# Altium schematic sheet ARDUINO_extension_connectors.SchDoc: ARDUINO_extension_connectors
size A3; Date: Not used; ApprovedBy: Not used; CheckedBy: Not used; Author: Not used; CompanyName: STMicroelectronics; DrawnBy: Not used; Engineer: Not used; Organization: Not used; Address1: Not used; Address2: Not used; Address3: Not used; Address4: Not used; DocumentNumber: 5; Revision: Not used; SheetNumber: 5; SheetTotal: 9; CurrentTime: Not used; CurrentDate: Not used; Time: Not used; DocumentFullPathAndName: Not used; DocumentName: Not used; ModifiedDate: Not used; ImagePath: Not used; ProjectName: Not used; Application_BuildNumber: Not used
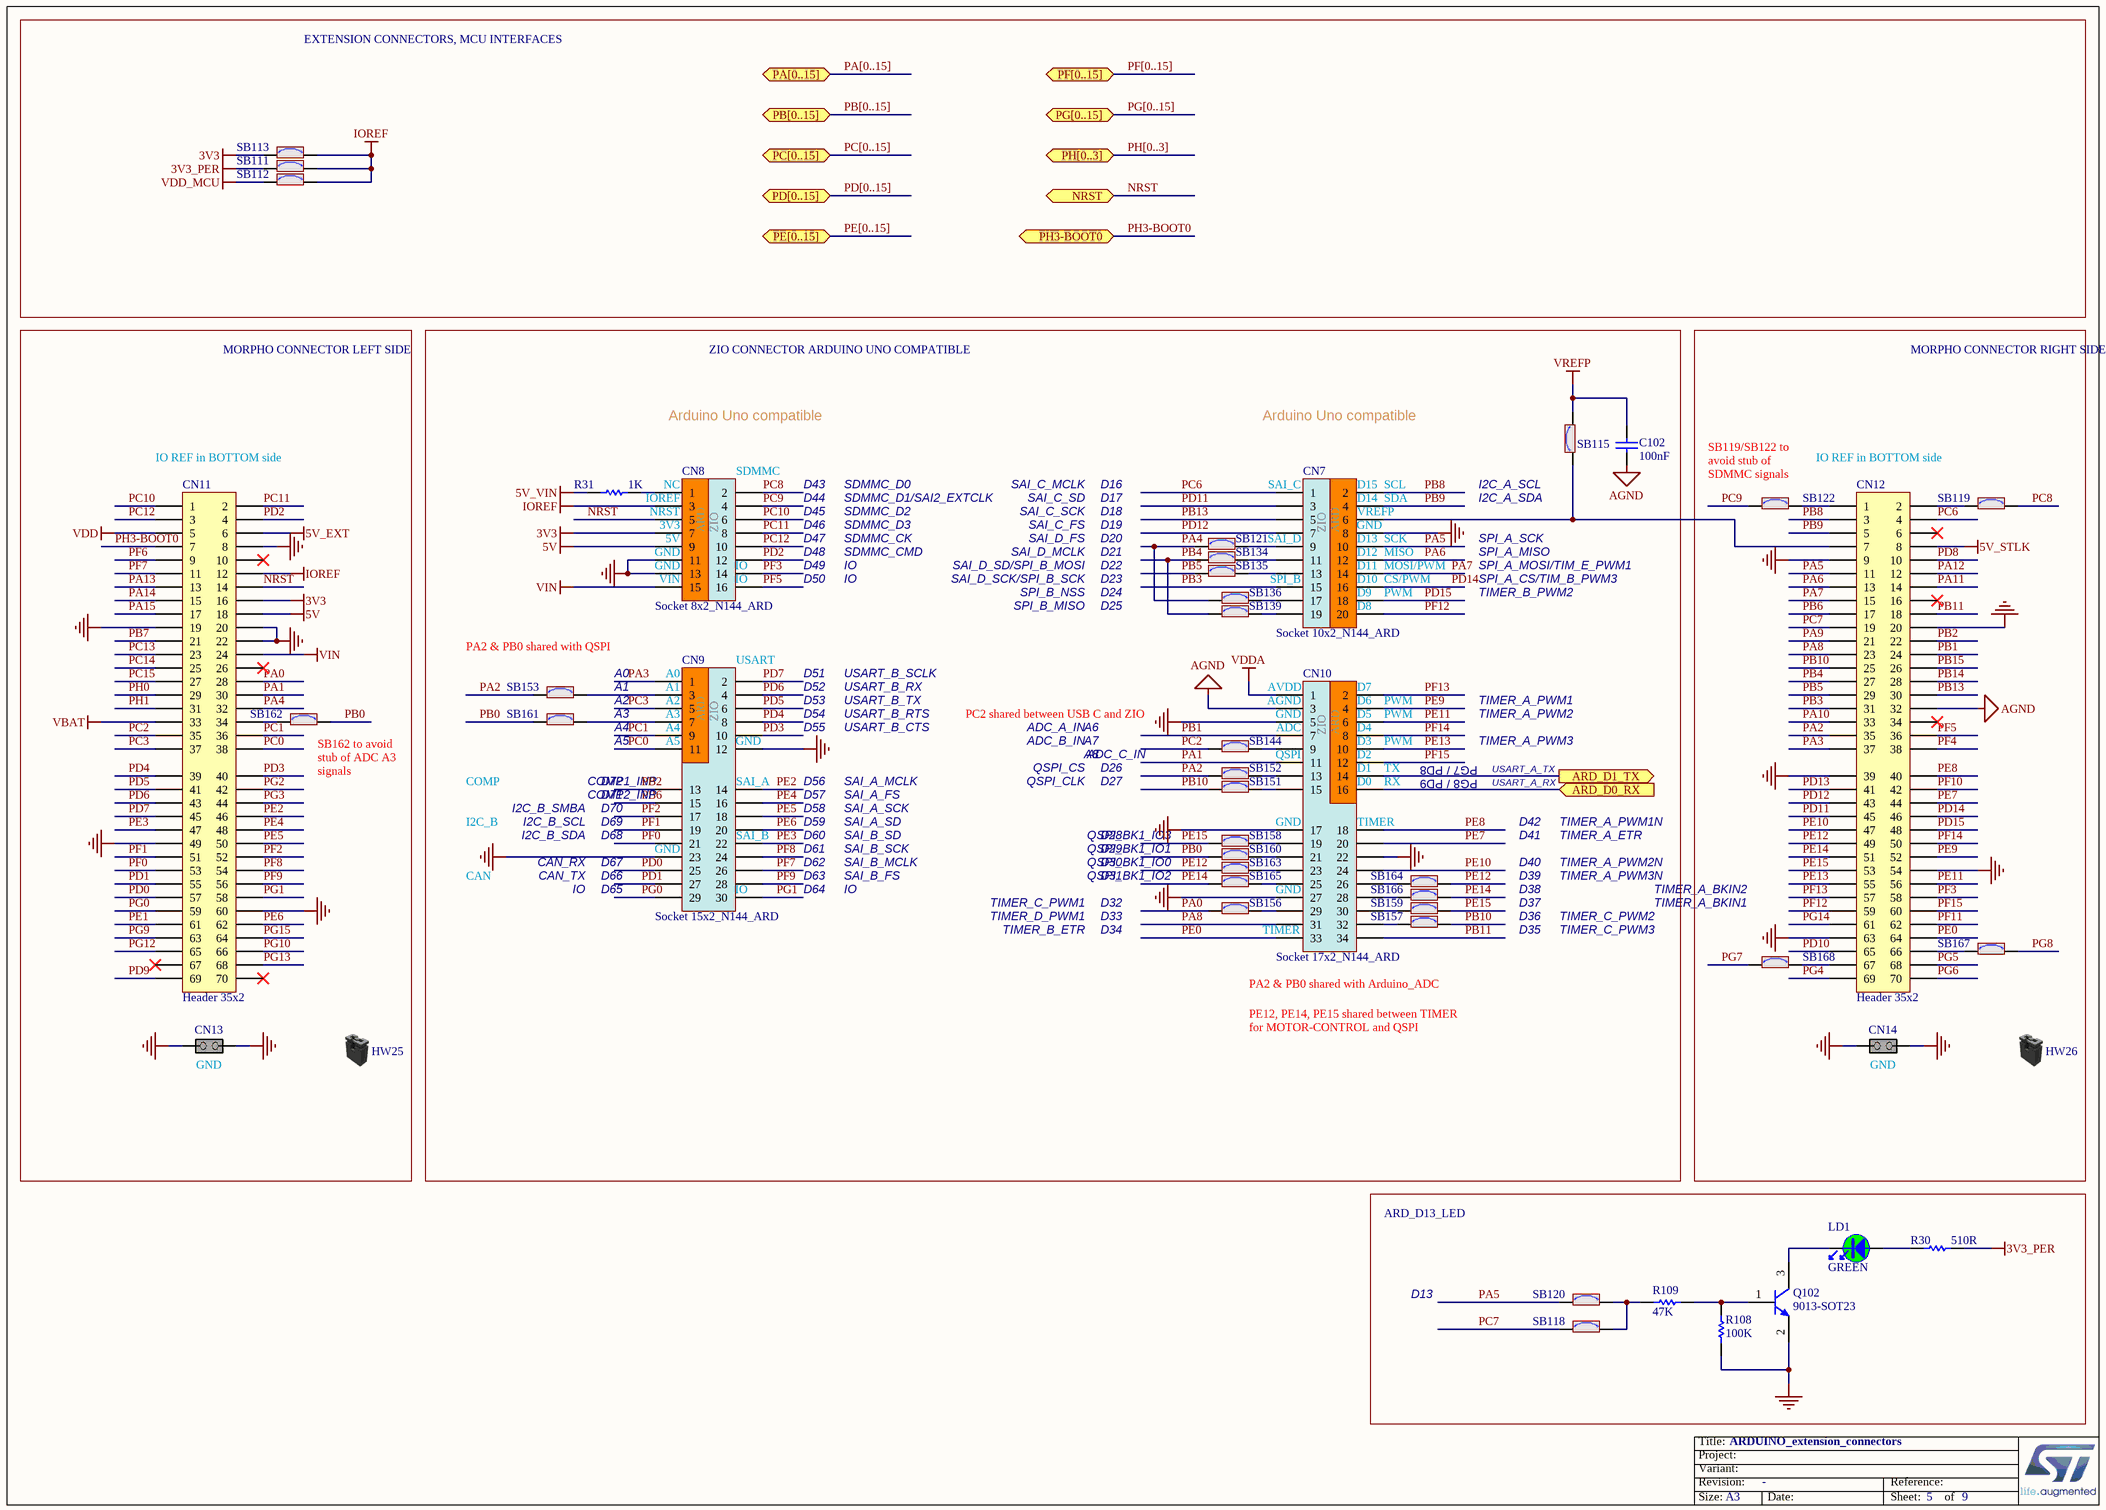
[diagram p0: ARDUINO_extension_connectors.SchDoc]

## Parts
C102  value 100nF  [C0603]
CN7  value Socket 10x2_N144_ARD  [CON_SAMTEC_SSW-110-23-X-D_N144_ARD]
CN8  value Socket 8x2_N144_ARD  [CON_SAMTEC_SSW-108-23-X-D_N144_ARD]
CN9  value Socket 15x2_N144_ARD  [CON_SAMTEC_SSW-115-23-X-D_N144_ARD]
CN10  value Socket 17x2_N144_ARD  [CON_SAMTEC_SSW-117-23-X-D_N144_ARD]
CN11  value Header 35x2  [CON_SAMTEC_TSW-135-07-X-D]
CN12  value Header 35x2  [CON_SAMTEC_TSW-135-07-X-D]
CN13  (no value)  [CON_SAMTEC_TSW-102-09-X-S]
CN14  (no value)  [CON_SAMTEC_TSW-102-09-X-S]
HW25  (no value)  (mechanical)
HW26  (no value)  (mechanical)
LD1  value GREEN  [LED_0603_GREEN]
Q102  value 9013-SOT23  [NPN_SOT23]
R30  value 510R  [R0603]
R31  value 1K  [R0603]
R108  value 100K  [R0603]
R109  value 47K  [R0603]
SB111  (no value)  [SOLDER-BRIDGE_R0603-0R]
SB112  (no value)  [SOLDER-BRIDGE_R0603-0R]
SB113  (no value)  [SOLDER-BRIDGE_R0603-0R]
SB115  (no value)  [SOLDER-BRIDGE_R0603-0R]
SB118  (no value)  [SOLDER-BRIDGE_R0603-0R]
SB119  (no value)  [SOLDER-BRIDGE_R0603-0R]
SB120  (no value)  [SOLDER-BRIDGE_R0603-0R]
SB121  (no value)  [SOLDER-BRIDGE_R0603-0R]
SB122  (no value)  [SOLDER-BRIDGE_R0603-0R]
SB134  (no value)  [SOLDER-BRIDGE_R0603-0R]
SB135  (no value)  [SOLDER-BRIDGE_R0603-0R]
SB136  (no value)  [SOLDER-BRIDGE_R0603-0R]
SB139  (no value)  [SOLDER-BRIDGE_R0603-0R]
SB144  (no value)  [SOLDER-BRIDGE_R0603-0R]
SB151  (no value)  [SOLDER-BRIDGE_R0603-0R]
SB152  (no value)  [SOLDER-BRIDGE_R0603-0R]
SB153  (no value)  [SOLDER-BRIDGE_R0603-0R]
SB156  (no value)  [SOLDER-BRIDGE_R0603-0R]
SB157  (no value)  [SOLDER-BRIDGE_R0603-0R]
SB158  (no value)  [SOLDER-BRIDGE_R0603-0R]
SB159  (no value)  [SOLDER-BRIDGE_R0603-0R]
SB160  (no value)  [SOLDER-BRIDGE_R0603-0R]
SB161  (no value)  [SOLDER-BRIDGE_R0603-0R]
SB162  (no value)  [SOLDER-BRIDGE_R0603-0R]
SB163  (no value)  [SOLDER-BRIDGE_R0603-0R]
SB164  (no value)  [SOLDER-BRIDGE_R0603-0R]
SB165  (no value)  [SOLDER-BRIDGE_R0603-0R]
SB166  (no value)  [SOLDER-BRIDGE_R0603-0R]
SB167  (no value)  [SOLDER-BRIDGE_R0603-0R]
SB168  (no value)  [SOLDER-BRIDGE_R0603-0R]

## Blocks framed on the sheet
EXTENSION CONNECTORS, MCU INTERFACES: SB111-SB113

## Ports
ARD_D0_RX (in), ARD_D1_TX (out), NRST, PA[0..15] (bidir), PB[0..15] (bidir), PC[0..15] (bidir), PD[0..15] (bidir), PE[0..15] (bidir), PF[0..15] (bidir), PG[0..15] (bidir), PH3-BOOT0, PH[0..3] (bidir)

## Nets
3V3: CN8.7 CN11.16 SB113.1
3V3_PER: R30.2 SB111.1
5V: CN8.9 CN11.18
5V_EXT: CN11.6
5V_STLK: CN12.8
5V_VIN: R31.2
AGND: C102.1 CN10.3 CN12.32
GND: CN7.8 CN8.11 CN8.13 CN9.12 CN9.23 CN10.5 CN10.17 CN10.22 CN10.27 CN11.8 CN11.19 CN11.20 CN11.22 CN11.49 CN11.60 CN12.9 CN12.20 CN12.39 CN12.54 CN12.63 CN13.1(COMMON) CN13.2(NO) CN14.1(COMMON) CN14.2(NO) Q102.2(E) R108.1
IOREF: CN8.3 CN11.12 SB111.2 SB112.2 SB113.2
VBAT: CN11.33
VDD: CN11.5
VDD_MCU: SB112.1
VDDA: CN10.1
VIN: CN8.15 CN11.24
VREFP: C102.2 SB115.2
ARD_D0_RX: CN10.16 ; port ARD_D0_RX
ARD_D1_TX: CN10.14 ; port ARD_D1_TX
NRST: CN8.5 CN11.14 ; port NRST
PA0: CN11.28 SB156.1
PA1: CN10.11 CN11.30
PA2: CN12.35 SB152.1 SB153.1
PA3: CN9.1 CN12.37
PA4: CN11.32 SB121.1 SB136.1
PA5: CN7.10 CN12.11 SB120.1
PA6: CN7.12 CN12.13
PA7: CN7.14 CN12.15
PA8: CN10.31 CN12.23
PA9: CN12.21
PA10: CN12.33
PA11: CN12.14
PA12: CN12.12
PA13: CN11.13
PA14: CN11.15
PA15: CN11.17
PB0: SB160.1 SB161.1 SB162.2
PB1: CN10.7 CN12.24
PB2: CN9.13 CN12.22
PB3: CN7.15 CN12.31
PB4: CN12.27 SB134.1 SB139.1
PB5: CN12.29 SB135.1
PB6: CN9.15 CN12.17
PB7: CN11.21
PB8: CN7.2 CN12.3
PB9: CN7.4 CN12.5
PB10: CN12.25 SB151.1 SB157.2
PB11: CN10.34 CN12.18
PB13: CN7.5 CN12.30
PB14: CN12.28
PB15: CN12.26
PC0: CN9.11 CN11.38
PC1: CN9.9 CN11.36
PC2: CN11.35 SB144.1
PC3: CN9.5 CN11.37
PC6: CN7.1 CN12.4
PC7: CN12.19 SB118.1
PC8: CN8.2 SB119.2
PC9: CN8.4 SB122.1
PC10: CN8.6 CN11.1
PC11: CN8.8 CN11.2
PC12: CN8.10 CN11.3
PC13: CN11.23
PC14: CN11.25
PC15: CN11.27
PD0: CN9.25 CN11.57
PD1: CN9.27 CN11.55
PD2: CN8.12 CN11.4
PD3: CN9.10 CN11.40
PD4: CN9.8 CN11.39
PD5: CN9.6 CN11.41
PD6: CN9.4 CN11.43
PD7: CN9.2 CN11.45
PD8: CN12.10
PD9: CN11.69
PD10: CN12.65
PD11: CN7.3 CN12.45
PD12: CN7.7 CN12.43
PD13: CN12.41
PD14: CN7.16 CN12.46
PD15: CN7.18 CN12.48
PE0: CN10.33 CN12.64
PE1: CN11.61
PE2: CN9.14 CN11.46
PE3: CN9.22 CN11.47
PE4: CN9.16 CN11.48
PE5: CN9.18 CN11.50
PE6: CN9.20 CN11.62
PE7: CN10.20 CN12.44
PE8: CN10.18 CN12.40
PE9: CN10.4 CN12.52
PE10: CN10.24 CN12.47
PE11: CN10.6 CN12.56
PE12: CN12.49 SB163.1 SB164.2
PE13: CN10.10 CN12.55
PE14: CN12.51 SB165.1 SB166.2
PE15: CN12.53 SB158.1 SB159.2
PF0: CN9.21 CN11.53
PF1: CN9.19 CN11.51
PF2: CN9.17 CN11.52
PF3: CN8.14 CN12.58
PF4: CN12.38
PF5: CN8.16 CN12.36
PF6: CN11.9
PF7: CN9.26 CN11.11
PF8: CN9.24 CN11.54
PF9: CN9.28 CN11.56
PF10: CN12.42
PF11: CN12.62
PF12: CN7.20 CN12.59
PF13: CN10.2 CN12.57
PF14: CN10.8 CN12.50
PF15: CN10.12 CN12.60
PG0: CN9.29 CN11.59
PG1: CN9.30 CN11.58
PG2: CN11.42
PG3: CN11.44
PG4: CN12.69
PG5: CN12.68
PG6: CN12.70
PG7: SB168.1
PG8: SB167.2
PG9: CN11.63
PG10: CN11.66
PG12: CN11.65
PG13: CN11.68
PG14: CN12.61
PG15: CN11.64
PH0: CN11.29
PH1: CN11.31
PH3-BOOT0: CN11.7 ; port PH3-BOOT0
NetCN7_6: CN7.6 CN12.7 SB115.1
NetCN7_9: CN7.9 SB121.2
NetCN7_11: CN7.11 SB134.2
NetCN7_13: CN7.13 SB135.2
NetCN7_17: CN7.17 SB136.2
NetCN7_19: CN7.19 SB139.2
NetCN8_1: CN8.1 R31.1
NetCN9_3: CN9.3 SB153.2
NetCN9_7: CN9.7 SB161.2
NetCN10_9: CN10.9 SB144.2
NetCN10_13: CN10.13 SB152.2
NetCN10_15: CN10.15 SB151.2
NetCN10_19: CN10.19 SB158.2
NetCN10_21: CN10.21 SB160.2
NetCN10_23: CN10.23 SB163.2
NetCN10_25: CN10.25 SB165.2
NetCN10_26: CN10.26 SB164.1
NetCN10_28: CN10.28 SB166.1
NetCN10_29: CN10.29 SB156.2
NetCN10_30: CN10.30 SB159.1
NetCN10_32: CN10.32 SB157.1
NetCN11_34: CN11.34 SB162.1
NetCN12_1: CN12.1 SB122.2
NetCN12_2: CN12.2 SB119.1
NetCN12_66: CN12.66 SB167.1
NetCN12_67: CN12.67 SB168.2
NetLD1_1: LD1.1 R30.1
NetLD1_2: LD1.2 Q102.3(C)
NetQ102_1: Q102.1(B) R108.2 R109.2
NetR109_1: R109.1 SB118.2 SB120.2

Not connected (* = marked no-connect by the designer): CN11 10* 26* 67* 70*; CN12 6* 16* 34*

## Buses and harness runs
bus PA[0..15] = port PA[0..15]
bus PB[0..15] = port PB[0..15]
bus PC[0..15] = port PC[0..15]
bus PD[0..15] = port PD[0..15]
bus PE[0..15] = port PE[0..15]
bus PF[0..15] = port PF[0..15]
bus PG[0..15] = port PG[0..15]
bus PH[0..3] = port PH[0..3]

## Notes on the sheet
- MORPHO CONNECTOR LEFT SIDE
- ZIO CONNECTOR ARDUINO UNO COMPATIBLE
- MORPHO CONNECTOR RIGHT SIDE
- Arduino Uno compatible
- (near CN11) IO REF in BOTTOM side
- (near CN8) NC
- (near CN8) IOREF
- (near CN8) NRST
- (near CN8) SDMMC
- D43
- D44
- D45
- SDMMC_D0
- SDMMC_D1/SAI2_EXTCLK
- SDMMC_D2
- SAI_C_SD
- SAI_C_SCK
- SAI_C_MCLK
- D16
- D17
- D18
- (near CN7) SAI_C
- (near CN7) VREFP
- (near CN7) D14
- (near CN7) D15
- (near CN7) SCL
- (near CN7) SDA
- (near SB115) I2C_A_SCL
- I2C_A_SDA
- (near SB122) SB119/SB122 to avoid stub of SDMMC signals
- IO REF in BOTTOM side
- (near CN8) 3V3
- (near CN8) 5V
- (near CN8) GND
- (near CN8) VIN
- (near CN8) IO
- D46
- D47
- D48
- D49
- D50
- SDMMC_CK
- SDMMC_CMD
- SDMMC_D3
- IO
- SAI_C_FS
- SAI_D_SD/SPI_B_MOSI
- SAI_D_SCK/SPI_B_SCK
- SAI_D_FS
- SAI_D_MCLK
- D19
- D20
- D21
- D22
- D23
- (near CN7) SPI_B
- (near CN7) SAI_D
- (near CN7) D10
- (near CN7) D11
- (near CN7) D12
- (near CN7) D13
- (near CN7) SCK
- (near CN7) GND
- (near CN7) MISO
- (near CN7) MOSI/PWM
- (near CN7) CS/PWM
- SPI_A_CS/TIM_B_PWM3
- SPI_A_MOSI/TIM_E_PWM1
- SPI_A_SCK
- SPI_A_MISO
- PA2 & PB0 shared with QSPI
- SPI_B_MISO
- SPI_B_NSS
- D24
- D25
- (near CN7) D8
- (near CN7) D9
- (near CN7) PWM
- TIMER_B_PWM2
- A0
- A1
- A2
- A3
- (near CN9) A0
- (near CN9) A1
- (near CN9) A2
- (near CN9) A3
- (near CN9) USART
- D51
- D52
- D53
- D54
- USART_B_TX
- USART_B_RX
- USART_B_SCLK
- USART_B_RTS
- PC2 shared between USB C and ZIO
- (near CN10) GND
- (near CN10) AVDD
- (near CN10) AGND
- (near CN10) D7
- (near CN10) D6
- (near CN10) D5
- (near CN10) PWM
- TIMER_A_PWM1
- TIMER_A_PWM2
- (near SB162) SB162 to avoid stub of ADC A3 signals
- COMP
- COMP1_INP
- D72
- A4
- A5
- (near CN9) A4
- (near CN9) A5
- (near CN9) SAI_A
- (near CN9) GND
- D55
- D56
- SAI_A_MCLK
- USART_B_CTS
- QSPI_CLK
- QSPI_CS
- ADC_A_IN
- ADC_B_IN
- ADC_C_IN
- A6
- A7
- A8
- D26
- D27
- (near CN10) ADC
- (near CN10) QSPI
- (near CN10) D2
- (near CN10) D4
- (near CN10) D3
- (near CN10) D1
- (near CN10) D0
- (near CN10) TX
- (near CN10) RX
- TIMER_A_PWM3
- PG8 / PD9
- PG7 / PD8
- USART_A_TX
- USART_A_RX
- I2C_B
- I2C_B_SCL
- I2C_B_SDA
- I2C_B_SMBA
- COMP2_INP
- D71
- D70
- D69
- D68
- (near CN9) SAI_B
- D57
- D58
- D59
- D60
- D61
- SAI_A_SD
- SAI_A_SCK
- SAI_A_FS
- SAI_B_SD
- SAI_B_SCK
- QSPI_BK1_IO1
- QSPI_BK1_IO3
- D28
- D29
- (near CN10) TIMER
- D41
- D42
- TIMER_A_PWM1N
- TIMER_A_ETR
- CAN
- CAN_TX
- CAN_RX
- D67
- D66
- D65
- (near CN9) IO
- D62
- D63
- D64
- SAI_B_FS
- SAI_B_MCLK
- TIMER_D_PWM1
- TIMER_C_PWM1
- QSPI_BK1_IO0
- QSPI_BK1_IO2
- D30
- D31
- D32
- D33
- D36
- D37
- D38
- D39
- D40
- TIMER_A_PWM2N
- TIMER_A_PWM3N
- TIMER_C_PWM2
- TIMER_A_BKIN1
- TIMER_A_BKIN2
- TIMER_B_ETR
- D34
- PA2 & PB0 shared with Arduino_ADC
- TIMER
- D35
- TIMER_C_PWM3
- PE12, PE14, PE15 shared between TIMER for MOTOR-CONTROL and QSPI
- (near CN13) GND
- (near CN14) GND
- ARD_D13_LED
- D13
- Title:
- Project:
- Size:
- Revision:
- Variant:
- -
- Date:
- Reference:
- Sheet:
- of
- (in symbol MCD-01037) ARD; ZIO
- (in symbol MCD-01039) ZIO; ARD
- (in symbol MCD-01040) ARD; ZIO
- (in symbol MCD-01041) ZIO; ARD

## Library data of the parts
C102 = MCD-00211: Capacitor, MLCC, 100nF, 16V, X7R, 10%, 0603, T=0,8mm; Manufacturer_Part_Number: CC0603KRX7R7BB104; Manufacturer: YAGEO; Provided_By: Subcon; Initial_Board_Reference: MB1319; Internal_Part_Number: MCD-00211; ECCN_US: n/a; ECCN_EU: n/a; ComponentLink1Description: Datasheet; Status: Released; Part_Type: Capacitor; Package: C0603; ComponentLink1URL: http://tunmcdsvn.tun.st.com/Component_Datasheet_Library/Trunk/Capacitors/Yageo_Multilayer_Capacitor_X7R_series_100pF_to_22uF
CN7 = MCD-01039: Socket, 10x2, 2.54mm, VR, TH, Height 8.51mm/10mm, Low insertion force.; Part_Type: Connector; Manufacturer_Part_Number: SSW-110-23-x-D; Manufacturer: SAMTEC; Provided_By: Subcon; Initial_Board_Reference: MB1361; Remark: Socket dedicated to Arduino+ZIO connector on NUCLEO144; Internal_Part_Number: MCD-01039; Status: Checked; ComponentLink1Description: Datasheet; ComponentLink1URL: http://tunmcdsvn.tun.st.com/Component_Datasheet_Library/Trunk/Connectors/Samtec_SSW-SSQ-series; ECCN_US: n/a; ECCN_EU: n/a
CN8 = MCD-01037: Socket, 8x2, 2.54mm, VR, TH, Height 8.51mm/10mm, Low insertion force.; Part_Type: Connector; Manufacturer_Part_Number: SSW-108-23-x-D; Manufacturer: SAMTEC; Provided_By: Subcon; Initial_Board_Reference: MB1361; Remark: Socket dedicated to Arduino+ZIO connector on NUCLEO144; Internal_Part_Number: MCD-01037; Status: Checked; ComponentLink1Description: Datasheet; ComponentLink1URL: http://tunmcdsvn.tun.st.com/Component_Datasheet_Library/Trunk/Connectors/Samtec_SSW-SSQ-series; ECCN_US: n/a; ECCN_EU: n/a
CN9 = MCD-01040: Socket, 15x2, 2.54mm, VR, TH, Height 8.51mm/10mm, Low insertion force.; Part_Type: Connector; Manufacturer_Part_Number: SSW-115-23-x-D; Manufacturer: SAMTEC; Provided_By: Subcon; Initial_Board_Reference: MB1361; Remark: Socket dedicated to Arduino+ZIO connector on NUCLEO144; Internal_Part_Number: MCD-01040; Status: Checked; ComponentLink1Description: Datasheet; ComponentLink1URL: http://tunmcdsvn.tun.st.com/Component_Datasheet_Library/Trunk/Connectors/Samtec_SSW-SSQ-series; ECCN_US: n/a; ECCN_EU: n/a
CN10 = MCD-01041: Socket, 17x2, 2.54mm, VR, TH, Height 8.51mm/10mm, Low insertion force; Part_Type: Connector; Manufacturer_Part_Number: SSW-117-23-x-D; Manufacturer: SAMTEC; Provided_By: Subcon; Initial_Board_Reference: MB1361; Remark: Socket dedicated to Arduino+ZIO connector on NUCLEO144; Internal_Part_Number: MCD-01041; Status: Checked; ComponentLink1Description: Datasheet; ComponentLink1URL: http://tunmcdsvn.tun.st.com/Component_Datasheet_Library/Trunk/Connectors/Samtec_SSW-SSQ-series; ECCN_US: n/a; ECCN_EU: n/a
CN11 CN12 = MCD-01210: Header, 35x2, 2,54mm, VR, TH, Height 5.84mm/2.54mm; Part_Type: Connector; Manufacturer_Part_Number: TSW-135-07-x-D; Manufacturer: SAMTEC; Provided_By: Subcon; Initial_Board_Reference: MB1361; Internal_Part_Number: MCD-01210; Status: Checked; ComponentLink1Description: Datasheet; ComponentLink1URL: http://tunmcdsvn.tun.st.com/Component_Datasheet_Library/Trunk/Connectors/Samtec_TSW-HTSW-series; ECCN_US: n/a; ECCN_EU: n/a
CN13 CN14 = MCD-00214: Header, 2x1, 2,54mm, VR, TH, Height 5.84mm/10.16mm; Manufacturer_Part_Number: TSW-102-09-x-S; Manufacturer: SAMTEC; Part_Type: Connector; Value: Header 2x1 16mm; Provided_By: Subcon; Initial_Board_Reference: MB1319; Internal_Part_Number: MCD-00214; ECCN_US: n/a; ECCN_EU: n/a; ComponentLink1Description: Datasheet; Status: Released; ComponentLink1URL: http://tunmcdsvn.tun.st.com/Component_Datasheet_Library/Trunk/Connectors/Samtec_TSW-HTSW-series
HW25 HW26 = MCD-00043: SHUNT 2.54mm BLACK; Manufacturer_Part_Number: SNT-100-BK-G; Manufacturer: SAMTEC; Part_Type: Mechanical; Provided_By: Subcon; Initial_Board_Reference: MB1274; Internal_Part_Number: MCD-00043; ECCN_US: n/a; ECCN_EU: n/a; ComponentLink1Description: Datasheet; Status: Released; ComponentLink1URL: http://tunmcdsvn.tun.st.com/Component_Datasheet_Library/Trunk/Connectors/Samtec_Shunt_Jumper_SNT100
LD1 = MCD-00050: LED, Green, 0603; Part_Type: Display; Manufacturer_Part_Number: 19-213SYGC/S530-E2/TR8; Manufacturer: EVERLIGHT; ECCN_US: EAR99; ECCN_EU: NEC; Provided_By: Subcon; Initial_Board_Reference: MB1274; Internal_Part_Number: MCD-00050; Status: Released; ComponentLink1Description: Datasheet; Package: LED 0603; ComponentLink1URL: http://tunmcdsvn.tun.st.com/Component_Datasheet_Library/Trunk/Display/Everlight_SMD-LED-GREEN_19-213SYGC-S530-XX-TR8-v3.doc
Q102 = MCD-00073: NPN Bipolar Transistor; Part_Type: IC; Manufacturer_Part_Number: BSR14; Manufacturer: NXP; ECCN_US: EAR99; ECCN_EU: NEC; Provided_By: Subcon; Initial_Board_Reference: MB1274; Revision: *; Internal_Part_Number: MCD-00073; Status: Released; ComponentLink1Description: Datasheet; ComponentLink1URL: http://tunmcdsvn.tun.st.com/Component_Datasheet_Library/Trunk/IC/NXP_Transistor_BSR14
R30 = MCD-00225: Resistor,510R,0603,1%,1/10W; Manufacturer_Part_Number: RC0603FR-07510RL; Manufacturer: YAGEO; Provided_By: Subcon; Initial_Board_Reference: MB1319; Internal_Part_Number: MCD-00225; Status: Released; Part_Type: Resistor; ComponentLink1Description: Datasheet; ECCN_US: n/a; ECCN_EU: n/a; Package: R0603; ComponentLink1URL: http://tunmcdsvn.tun.st.com/Component_Datasheet_Library/Trunk/Resistors/Yageo_Resistor_RC0603-series
R31 = MCD-00070: Resistor,1K,0603,1%,1/10W; Manufacturer_Part_Number: RC0603FR-071KL; Manufacturer: YAGEO; Provided_By: Subcon; Initial_Board_Reference: MB1274; Internal_Part_Number: MCD-00070; ECCN_US: n/a; ECCN_EU: n/a; ComponentLink1Description: Datasheet; Status: Released; Part_Type: Resistor; Package: R0603; ComponentLink1URL: http://tunmcdsvn.tun.st.com/Component_Datasheet_Library/Trunk/Resistors/Yageo_Resistor_RC0603-series
R108 = MCD-00223: Resistor,100K,0603,1%,1/10W; Manufacturer_Part_Number: RC0603FR-07100KL; Manufacturer: YAGEO; Provided_By: Subcon; Initial_Board_Reference: MB1319; Internal_Part_Number: MCD-00223; Status: Released; Part_Type: Resistor; ComponentLink1Description: Datasheet; ECCN_US: n/a; ECCN_EU: n/a; Package: R0603; ComponentLink1URL: http://tunmcdsvn.tun.st.com/Component_Datasheet_Library/Trunk/Resistors/Yageo_Resistor_RC0603-series
R109 = MCD-00222: Resistor,47K,0603,1%,1/10W; Manufacturer_Part_Number: RC0603FR-0747KL; Manufacturer: YAGEO; Provided_By: Subcon; Initial_Board_Reference: MB1319; Internal_Part_Number: MCD-00222; Status: Released; Part_Type: Resistor; ComponentLink1Description: Datasheet; ECCN_US: n/a; ECCN_EU: n/a; Package: R0603; ComponentLink1URL: http://tunmcdsvn.tun.st.com/Component_Datasheet_Library/Trunk/Resistors/Yageo_Resistor_RC0603-series
SB111-SB113 SB115 SB118-SB122 SB134-SB136 SB139 SB144 SB151-SB153 SB156-SB168 = MCD-00071: Solder Bridge ON; Part_Type: Mechanical; Provided_By: Subcon; Initial_Board_Reference: MB1274; Internal_Part_Number: MCD-00071; ECCN_US: n/a; ECCN_EU: n/a; Status: Released; ComponentLink1Description: Datasheet